# Altium schematic sheet Sensor Bar 2.0 regulators.SchDoc
size A4
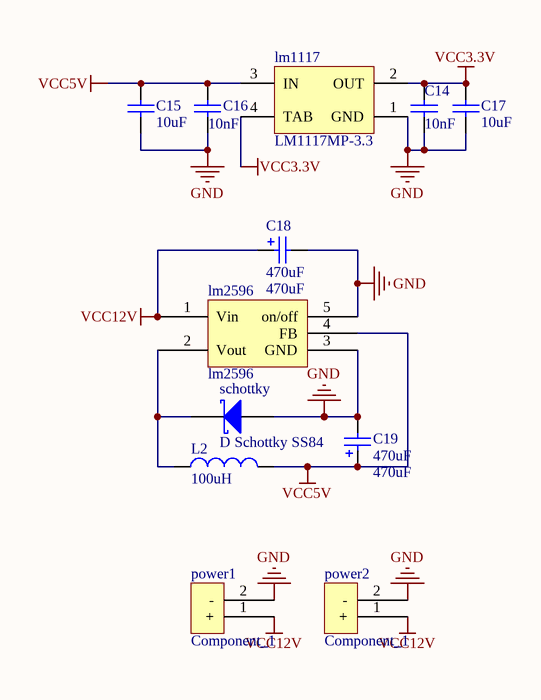
[diagram p0: Sensor Bar 2.0 regulators.SchDoc]

## Parts
C14  10nF  [CC2012-0805]
C15  10uF  [CC3225-1210]
C16  10nF  [CC2012-0805]
C17  10uF  [CC3225-1210]
C18  470uF  [470UF/50V]
C19  470uF  [470UF/50V]
L2  100uH  [MSS1260]
lm1117  LM1117MP-3.3  [MP04A_N]
lm2596  lm2596  [lm2596]
power1  Component_1  [PCBComponent_1]
power2  Component_1  [PCBComponent_1]
schottky  D Schottky SS84  [sch_diode]

## Nets
GND: C14.1 C15.2 C16.1 C17.2 C18.2 C19.2 lm1117.1(GND) lm2596.3(GND) lm2596.5(on/off) power1.2(-) power2.2(-) schottky.2(B)
VCC3.3V: C14.2 C17.1 lm1117.2(OUT) lm1117.4(TAB)
VCC5V: C15.1 C16.2 C19.1 L2.2 lm1117.3(IN) lm2596.4(FB)
VCC12V: C18.1 lm2596.1(Vin) power1.1(+) power2.1(+)
NetL2_1: L2.1 lm2596.2(Vout) schottky.1(A)

## Library data of the parts
C14-C17 = Cap Semi: Capacitor (Semiconductor SIM Model); Published: 8-Jun-2000; LatestRevisionDate: 17-Jul-2002; LatestRevisionNote: Re-released for DXP Platform.; PackageReference: C1206; Publisher: Altium Limited
C18 C19 = Cap Pol3: Polarized Capacitor (Surface Mount); Published: 8-Jun-2000; LatestRevisionDate: 29-May-2009; LatestRevisionNote: IPC-7351 Footprint Added.; PackageReference: C0805; Publisher: Altium Limited; PackageDescription: Chip Capacitor; Value: 470uF
L2 = Inductor: Published: 8-Jun-2000; Revision: July-2002: Re-released for DXP Platform.; Publisher: Altium Limited; Value: 100uH
lm1117 = LM1117MP-3.3: 800mA Low-Dropout Linear Regulator; Manufacturer: National Semiconductor; CompType: LDO IC; PackageTopMarking: XYTT*N05A; PowerWise: N; Published: 4-Dec-2008; DatasheetVersion: Apr-2006; PackageVersion: revB, Apr-2003; PackageReference: MP04A; Publisher: Altium Limited; PackageDescription: Molded SOT-223, 6.50 x 3.56 x 1.6mm Body, 4 Lead, 2.3mm Pitch; PartNumber: LM1117MP-3.3; RoHS: O; PinCount: 4; DigiKeyPartNumber: LM1117MP-3.3CT-ND; Code_JEDEC: TO-261-AA; Code_IPC: SOT223-4; ComponentLink1Description: LM1117 Datasheet; ComponentLink1URL: http://www.national.com/ds/LM/LM1117.pdf; ComponentLink2Description: LM1117 Web Page; ComponentLink2URL: http://www.national.com/pf/LM/LM1117.html; ComponentLink3Description: MP04A Package Page; ComponentLink3URL: http://www.national.com/packaging/folders/mp04a.html
lm2596 = Component_1
schottky = D Schottky: Schottky Diode; Code - JEDEC: DO-214-AA; Published: 8-Jun-2000; Revision: July-2002: Re-released for DXP Platform.; Publisher: Altium Limited